# Altium schematic sheet STPedal_Audio.SchDoc
size A4; SheetNumber: 2; SheetTotal: 4
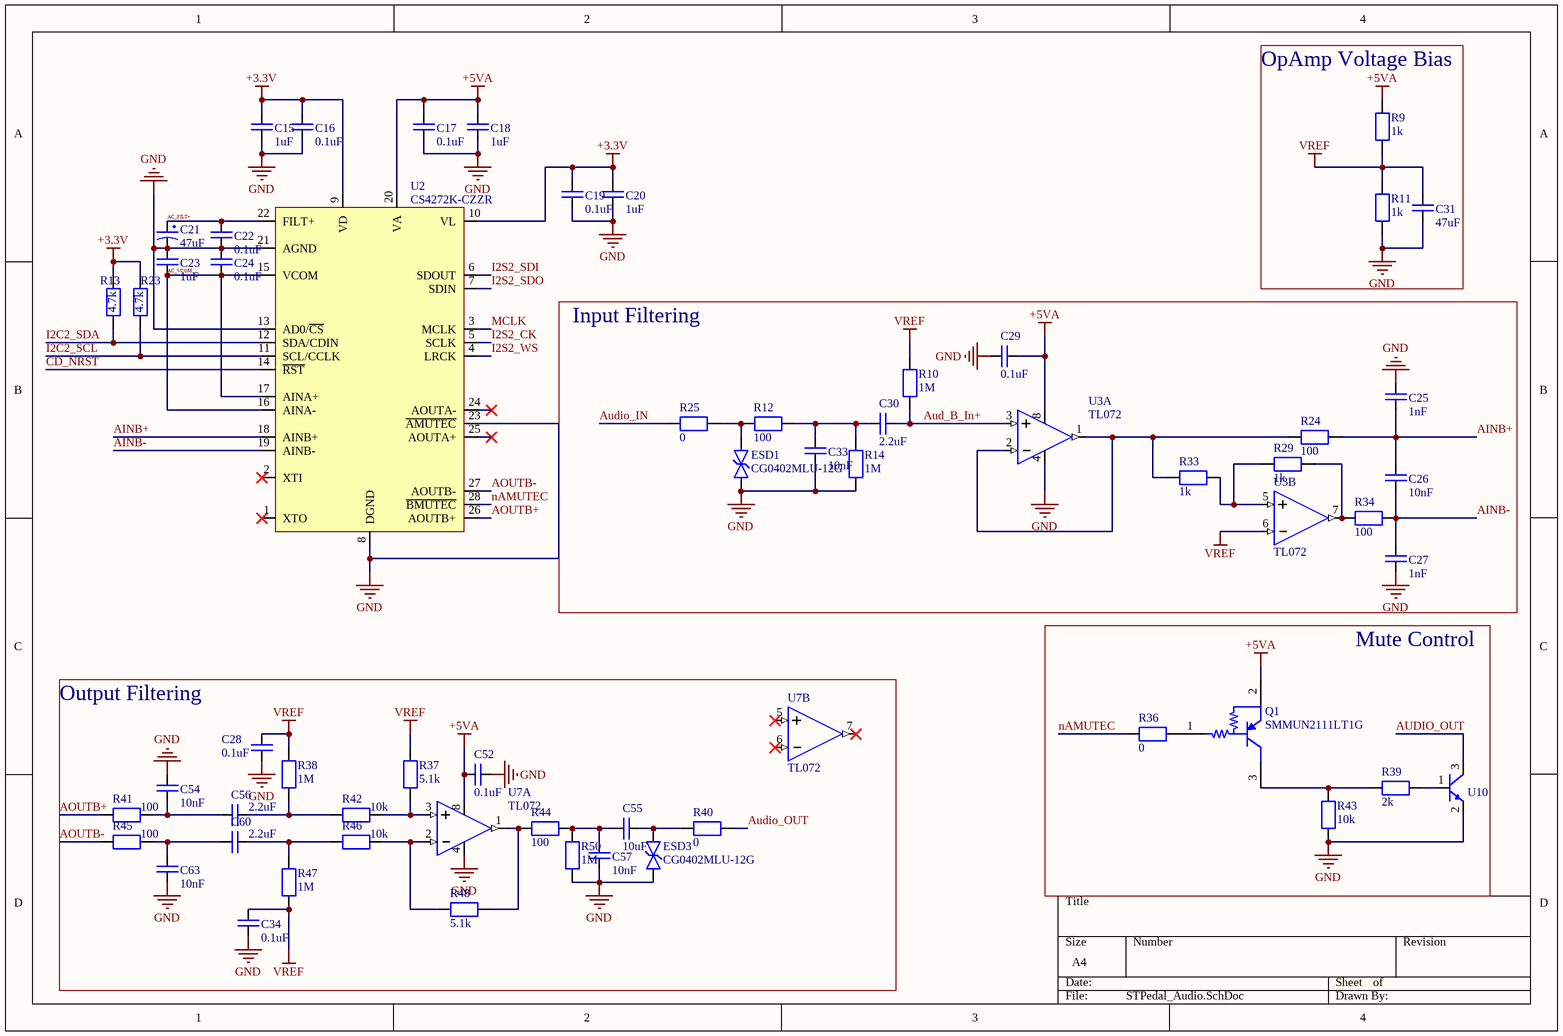
[diagram p0: STPedal_Audio.SchDoc]

## Parts
C15  1uF  [CAPC_0402_1005X55N]
C16  0.1uF  [CAPC_0402_1005X55N]
C17  0.1uF  [CAPC_0402_1005X55N]
C18  1uF  [CAPC_0402_1005X55N]
C19  0.1uF  [CAPC_0402_1005X55N]
C20  1uF  [CAPC_0402_1005X55N]
C21  47uF  [SMD,D6.3xL5.4mm]
C22  0.1uF  [CAPC_0402_1005X55N]
C23  1uF  [CAPC_0402_1005X55N]
C24  0.1uF  [CAPC_0402_1005X55N]
C25  1nF  [CAPC_0402_1005X55N]
C26  10nF  [CAPC_0402_1005X55N]
C27  1nF  [CAPC_0402_1005X55N]
C28  0.1uF  [CAPC_0402_1005X55N]
C29  0.1uF  [CAPC_0402_1005X55N]
C30  2.2uF  [CAPC_0402_1005X55N]
C31  47uF  [CAPC_0805_2012X145N]
C33  10nF  [CAPC_0402_1005X55N]
C34  0.1uF  [CAPC_0402_1005X55N]
C52  0.1uF  [CAPC_0402_1005X55N]
C54  10nF  [CAPC_0402_1005X55N]
C55  10uF  [RESC_0603_1608X55N]
C56  2.2uF  [CAPC_0402_1005X55N]
C57  10nF  [CAPC_0402_1005X55N]
C60  2.2uF  [CAPC_0402_1005X55N]
C63  10nF  [CAPC_0402_1005X55N]
ESD1  CG0402MLU-12G  [DIOC_0402_1005X41N]
ESD3  CG0402MLU-12G  [DIOC_0402_1005X41N]
Q1  SMMUN2111LT1G  [ONSC-SOT-23-3-318-08_V]
R9  1k  [RESC_0402_1005X40N]
R10  1M  [RESC_0402_1005X40N]
R11  1k  [RESC_0402_1005X40N]
R12  100  [RESC_0402_1005X40N]
R13  4.7k  [RESC_0402_1005X40N]
R14  1M  [RESC_0402_1005X40N]
R23  4.7k  [RESC_0402_1005X40N]
R24  100  [RESC_0402_1005X40N]
R25  0  [RESC_0402_1005X40N]
R29  1k  [RESC_0402_1005X40N]
R33  1k  [RESC_0402_1005X40N]
R34  100  [RESC_0402_1005X40N]
R36  0  [RESC_0402_1005X40N]
R37  5.1k  [RESC_0402_1005X40N]
R38  1M  [RESC_0402_1005X40N]
R39  2k  [RESC_0402_1005X40N]
R40  0  [RESC_0402_1005X40N]
R41  100  [RESC_0402_1005X40N]
R42  10k  [RESC_0402_1005X40N]
R43  10k  [RESC_0402_1005X40N]
R44  100  [RESC_0402_1005X40N]
R45  100  [RESC_0402_1005X40N]
R46  10k  [RESC_0402_1005X40N]
R47  1M  [RESC_0402_1005X40N]
R48  5.1k  [RESC_0402_1005X40N]
R50  1M  [RESC_0402_1005X40N]
U2  CS4272K-CZZR  [TSOP65P640X120-28N]
U3  TL072  [SO-8]  (parts A,B of 2)
U7  TL072  [SO-8]  (parts A,B of 2)
U10  FMMT619  [SOT95P240X115-3N]  (value not drawn)

## Blocks framed on the sheet
OpAmp Voltage Bias: C31 R9 R11
Input Filtering: C25-C27 C29 C30 C33 ESD1 R10 R12 R14 R24 R25 R29 R33 R34 U3
Mute Control: Q1 R36 R39 R43 U10
Output Filtering: C28 C34 C52 C54-C57 C60 C63 ESD3 R37 R38 R40-R42 R44-R48 R50 U7

## Nets
+3.3V: C15.2 C16.2 C19.2 C20.2 R13.2 R23.2 U2.9(VD) U2.10(VL)
+5VA: C17.2 C18.2 C29.1 C52.1 Q1.2(E) R9.2 U2.20(VA) U3.8 U7.8
GND: C15.1 C16.1 C17.1 C18.1 C19.1 C20.1 C21.2 C22.1 C23.2 C24.2 C25.1 C27.2 C28.2 C29.2 C31.1 C33.1 C34.2 C52.2 C54.2 C57.1 C63.1 ESD1.1 ESD3.1 R11.1 R14.1 R43.2 R50.1 U2.8(DGND) U2.13(AD0/~{CS}) U2.21(AGND) U2.23(~{AMUTEC}) U3.4 U7.4 U10.2
VREF: C28.1 C31.2 C34.1 R9.1 R10.2 R11.2 R37.2 R38.2 R47.1 U3.6
AC_FILT+: C21.1 C22.2 U2.22(FILT+)
AC_VCOM: C23.1 C24.1 U2.15(VCOM) U2.16(AINA-) U2.17(AINA+)
AINB+: C25.2 C26.2 R24.2 U2.18(AINB+)
AINB-: C26.1 C27.1 R34.2 U2.19(AINB-)
AOUTB+: R41.1 U2.26(AOUTB+)
AOUTB-: R45.1 U2.27(AOUTB-)
Aud_B_In+: C30.2 R10.1 U3.3
Audio_IN: R25.1
AUDIO_OUT: R40.2 U10.3
CD_NRST: U2.14(~{RST})
I2C2_SCL: R23.1 U2.11(SCL/CCLK)
I2C2_SDA: R13.1 U2.12(SDA/CDIN)
I2S2_CK: U2.5(SCLK)
I2S2_SDI: U2.6(SDOUT)
I2S2_SDO: U2.7(SDIN)
I2S2_WS: U2.4(LRCK)
MCLK: U2.3(MCLK)
nAMUTEC: R36.1 U2.28(~{BMUTEC})
NetC30_1: C30.1 C33.2 R12.2 R14.2
NetC54_1: C54.1 C56.1 R41.2
NetC55_1: C55.1 ESD3.2 R40.1
NetC55_2: C55.2 C57.2 R44.2 R50.2
NetC56_2: C56.2 R38.1 R42.1
NetC60_1: C60.1 C63.2 R45.2
NetC60_2: C60.2 R46.1 R47.2
NetESD1_2: ESD1.2 R12.1 R25.2
NetQ1_1: Q1.1(B) R36.2
NetQ1_3: Q1.3(C) R39.1 R43.1
NetR24_1: R24.1 R33.1 U3.1 U3.2
NetR29_1: R29.1 R33.2 U3.5
NetR29_2: R29.2 R34.1 U3.7
NetR37_1: R37.1 R42.2 U7.3
NetR39_2: R39.2 U10.1
NetR44_1: R44.1 R48.1 U7.1
NetR46_2: R46.2 R48.2 U7.2

Not connected (* = marked no-connect by the designer): U2 1(XTO)* 2(XTI)* 24(AOUTA-)* 25(AOUTA+)*; U7 5* 6* 7*

## Library data of the parts
C15 C18 C20 C23 = 1uF_CAP_0402: Capacitor 0402 - 1uF +-/10% / 25V; Manufacturer: Samsung Electro-Mechanics; MPN: CL05A105KA5NQNC; LCSC: C52923
C16 C17 C19 C22 C24 C28 C29 C34 C52 = 0.1uF_CAP_0402: Capacitor 0402 - 0.1uF +-/10% / 16V; Manufacturer: Samsung Electro-Mechanics; MPN: CL05B104KO5NNNC; LCSC: C1525
C21 = 47uF_JLCAP_Elect_D6.3mm: -55℃~+105℃ 2000hrs@105℃ 35V 47uF 5.4mm 6.3mm ±20% SMD,D6.3xL5.4mm Aluminum Electrolytic Capacitors - SMD ROHS; Manufactuer: Honor Elec; MPN: RVT1V470M0605; LCSC: C3344
C25 C27 = 1nF_CAP_0402: 1nF 50V X7R ±10% 0402 Multilayer Ceramic Capacitors MLCC - SMD/SMT ROHS; Manufacturer: FH (Guangdong Fenghua Advanced Tech); MPN: 0402B102K500NT; LCSC: C1523
C26 C33 C54 C57 C63 = 10nF_CAP_0402: Capacitor 0402 - 10nF +-/10% / 25V; Manufacturer: Samsung Electro-Mechanics; MPN: CL05B103KB5NNNC; LCSC: C15195
C30 C56 C60 = 2.2uF_CAP_0402: Capacitor 0402 - 2.2uF +-/10% / 25V; Manufacturer: Samsung Electro-Mechanics; MPN: CL05A225MQ5NSNC; LCSC: C12530
C31 = 47uF_CAP_0805: 47uF 6.3V X5R ±20% 0805 Multilayer Ceramic Capacitors MLCC - SMD/SMT ROHS; Manufacturer: Samsung Electro-Mechanics; MPN: CL21A476MQYNNNE; LCSC: C16780
C55 = 10uF_CAP_0603: Capacitor 0603 - 0.1uF +-/10% / 25V; Manufacturer: Samsung Electro-Mechanics; MPN: CL10A106MA8NRNC; LCSC: C96446
ESD1 ESD3 = CG0402MLU-12G: -40℃~+125℃ 0.05pF 1 12V 25V 5nA ESD IEC 61000-4-2 0402 ESD and Surge Protection (TVS/ESD) ROHS; Manufacturer: BOURNS; MPN: CG0402MLU-12G; LCSC: C2655716
Q1 = CMP-0630-00261-1: Digital Transistor (BRT), R1=10 kOhm, R2=10 kOhm, PNP Transistor, 3-Pin SOT-23, Pb-Free, Tape and Reel; Manufacturer: On Semiconductor; V(BR)CEO Min (V): 50; IC Continuous (A): 0.1; hFE Min: 35; R1/R2 Typ: 1; Mounting Technology: Surface Mount; ComponentLink1Description: Manufacturer URL; ComponentLink1URL: http://www.onsemi.com/; Polarity: PNP; ComponentLink3URL: http://www.onsemi.cn/pub_link/Collateral/318-08.PDF; RoHS: TRUE; ComponentLink3Description: Package Specification; DatasheetVersion: Rev. 7; PackageReference: SOT-23-3-318-08; PackageVersion: Rev. AP, 11/2009; ComponentLink2Description: Datasheet; ComponentLink2URL: http://www.onsemi.cn/pub_link/Collateral/DTA114E-D.PDF; PackageDescription: 3-Pin Small Outline Transistor, Body 2.92 x 1.3 mm, Pitch 0.95 mm; PartNumber: SMMUN2111LT1G; Packing: Tape and Reel; LCSC: C894362
R9 R11 R29 R33 = 1k_JLCRES-0402: Resistor 0402 - 1k; Manufacturer: UNI-ROYAL(Uniroyal Elec); MPN: 0402WGF1001TCE; LCSC: C11702
R10 R14 R38 R47 R50 = 1M_JLCRES-0402: -55℃~+155℃ 1MΩ 50V 62.5mW Thick Film Resistor ±1% ±100ppm/℃ 0402 Chip Resistor - Surface Mount ROHS; Manufacturer: UNI-ROYAL(Uniroyal Elec); MPN: 0402WGF1004TCE; LCSC: C26083
R12 R24 R34 R41 R44 R45 = 100R_JLCRES-0402: Resistor 0402 - 100R; Manufacturer: *; MPN: *; LCSC: C25076
R13 R23 = 4.7k_JLCRES-0402: -55℃~+155℃ 4.7kΩ 50V 62.5mW Thick Film Resistor ±1% ±100ppm/℃ 0402 Chip Resistor - Surface Mount ROHS; Manufacturer: UNI-ROYAL(Uniroyal Elec); MPN: 0402WGF4701TCE; LCSC: C25900
R25 R36 R40 = 0R_JLCRES-0402: -55℃~+155℃ 0Ω 50V 62.5mW Thick Film Resistor ±1% ±800ppm/℃ 0402 Chip Resistor - Surface Mount ROHS; Manufacturer: UNI-ROYAL(Uniroyal Elec); MPN: 0402WGF0000TCE; LCSC: C17168
R37 R48 = 5.1k_JLCRES-0402: -55℃~+155℃ 5.1kΩ 50V 62.5mW Thick Film Resistor ±1% ±100ppm/℃ 0402 Chip Resistor - Surface Mount ROHS; Manufacturer: UNI-ROYAL(Uniroyal Elec); MPN: 0402WGF5101TCE; LCSC: C25905
R39 = 2k_JLCRES-0402: -55℃~+155℃ 2kΩ 50V 62.5mW Thick Film Resistor ±1% ±100ppm/℃ 0402 Chip Resistor - Surface Mount ROHS; Manufacturer: UNI-ROYAL(Uniroyal Elec); MPN: 0402WGF2001TCE; LCSC: C4109
R42 R43 R46 = 10k_JLCRES-0402: -55℃~+155℃ 10kΩ 50V 62.5mW Thick Film Resistor ±1% ±100ppm/℃ 0402 Chip Resistor - Surface Mount ROHS; Manufacturer: UNI-ROYAL(Uniroyal Elec); MPN: 0402WGF1002TCE; LCSC: C25744
U2 = CS4272K-CZZR: -10℃~+70℃ 2.37V~5.25V、3.1V~5.25V、4.75V~5.25V 4kHz~192kHz Encoder/decoder On-chip digital gain、Mute control、Master-slave clock negotiation Serial TSSOP-28 Audio Interface ICs ROHS; Manufactuer: Cirrus Logic; MPN: CS4272K-CZZR; LCSC: C17197186; ComponentLink1Description: Datasheet; ComponentLink1URL: https://statics.cirrus.com/pubs/proDatasheet/CS4272_F2.pdf
U3 U7 = TL072CDT: 0℃~+70℃ 1.4mA 10uV/℃ 15nV/√Hz@1kHz 16V/us 2 20pA 36V 3mV 40mA 4MHz 5pA 6V~36V 86dB SO-8 FET Input Amplifiers ROHS; Manufacturer: STMicroelectronics; MPN: TL072CDT; LCSC: C6961
U10 = FMMT619_JLC_SOT23: -55℃~+150℃ 1 NPN 100nA 165MHz 200 200mV 2A 50V 625mW 7V NPN SOT-23 Bipolar (BJT) ROHS; Manufacturer: Diodes Incorporated; MPN: FMMT619TA; ComponentLink1Description: New link; ComponentLink1URL: *; LCSC: C15331